# Altium project InductSense-v0.PrjPcb
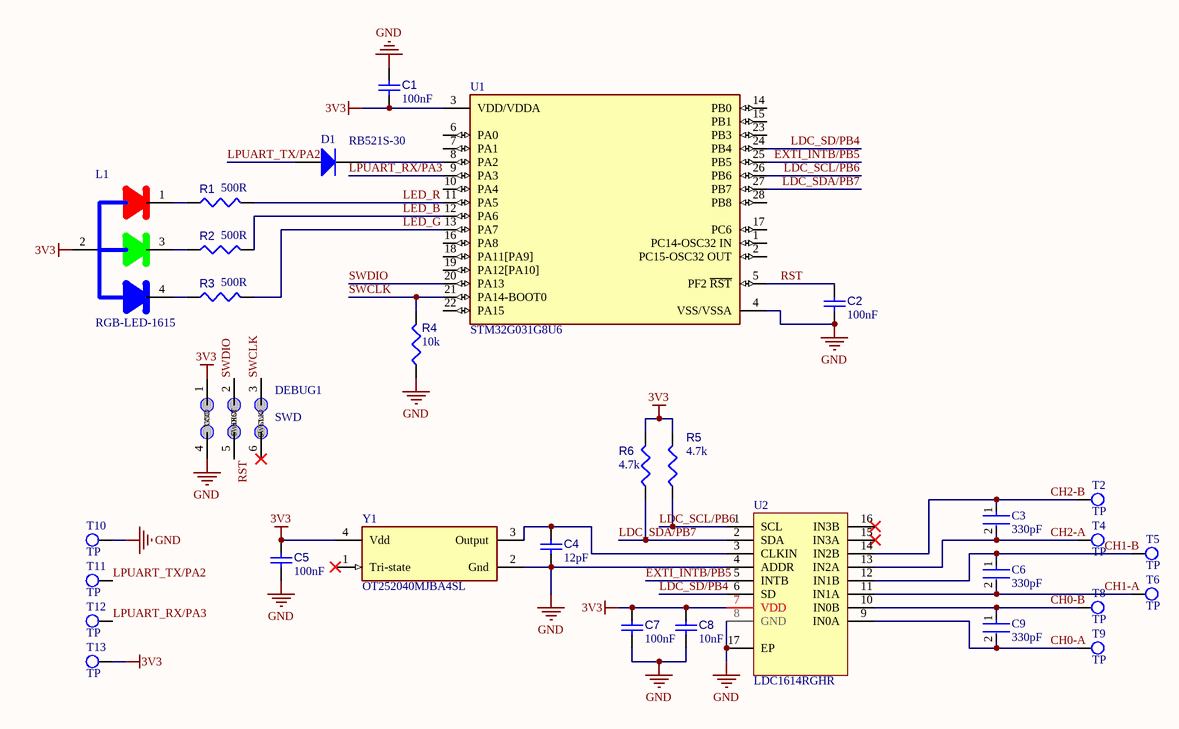
[diagram p0: Sheet1.SchDoc]
1 sheet, 31 parts. Net scope: global (net labels, ports and power ports of the same name join across sheets).
Board files: v0.0.PcbDoc, iForce-FPC.PcbDoc, v0.1.PcbDoc, iForce-FPC-V0.1.PcbDoc

## Sheet Sheet1.SchDoc
size A4; SheetNumber: 1; SheetTotal: 1

### Parts
C1  value 100nF  [CAPC0402(1005)60_L]  (hidden comment: Capacitor 100nF +/-20% 10V 0402)
C2  value 100nF  [CAPC0402(1005)60_L]  (hidden comment: Capacitor 100nF +/-20% 10V 0402)
C3  330pF  [FP-C0201-AB-MFG]
C4  value 12pF  [CAPC0402(1005)33_L]  (hidden comment: Capacitor 12pF +/-10% 50V 0402)
C5  value 100nF  [CAPC0402(1005)60_L]  (hidden comment: Capacitor 100nF +/-20% 10V 0402)
C6  330pF  [FP-C0201-AB-MFG]
C7  value 100nF  [CAPC0402(1005)60_L]  (hidden comment: Capacitor 100nF +/-20% 10V 0402)
C8  value 10nF  [CAPC0402(1005)60_L]  (hidden comment: Capacitor 100nF +/-20% 10V 0402)
C9  330pF  [FP-C0201-AB-MFG]
D1  RB521S-30  [DIOD-SOD523-2_V]
DEBUG1  SWD  [DEBUG-2x3P-1.27mm Pitch]
L1  RGB-LED-1615  [RGB-LED-1615-Footprint-1]
R1  value 500R  [RESC0402(1005)_L]  (hidden comment: Resistor 100R +/-1 % 0402 63 mW)
R2  value 500R  [RESC0402(1005)_L]  (hidden comment: Resistor 100R +/-1 % 0402 63 mW)
R3  value 500R  [RESC0402(1005)_L]  (hidden comment: Resistor 100R +/-1 % 0402 63 mW)
R4  value 10k  [RESC0402(1005)_L]  (hidden comment: Resistor 10K  +/-1 % 0402 63 mW)
R5  value 4.7k  [RESC0402(1005)_L]  (hidden comment: Resistor 4K7  +/-1 % 0402 63 mW)
R6  value 4.7k  [RESC0402(1005)_L]  (hidden comment: Resistor 4K7  +/-1 % 0402 63 mW)
T2  TP  [TESTPOINT-Rectangle-1.5x3]
T4  TP  [TESTPOINT-Rectangle-1.5x3]
T5  TP  [TESTPOINT-Rectangle-1.5x3]
T6  TP  [TESTPOINT-Rectangle-1.5x3]
T8  TP  [TESTPOINT-Rectangle-1.5x3]
T9  TP  [TESTPOINT-Rectangle-1.5x3]
T10  TP  [TESTPOINT-Rectangle-1.5x3]
T11  TP  [TESTPOINT-Rectangle-1.5x3]
T12  TP  [TESTPOINT-Rectangle-1.5x3]
T13  TP  [TESTPOINT-Rectangle-1.5x3]
U1  STM32G031G8U6  [FP-UFQFPN28-A0B0-MFG]
U2  LDC1614RGHR  [LDC1614RGHR-Footprint-1]
Y1  OT252040MJBA4SL  [FP-ECS-TXO-2520-MFG]

### Nets
3V3: C1.1 C5.2 C7.2 C8.2 DEBUG1.1(VCC) L1.2(COM+) R5.2 R6.2 T13.1 U1.3(VDD/VDDA) U2.7(VDD) Y1.4(Vdd)
GND: C1.2 C2.1 C4.1 C5.1 C7.1 C8.1 DEBUG1.4(GND) R4.1 T10.1 U1.4(VSS/VSSA) U2.4(ADDR) U2.8(GND) U2.17(EP) Y1.2(Gnd)
CH0-A: C9.2 T9.1 U2.9(IN0A)
CH0-B: C9.1 T8.1 U2.10(IN0B)
CH1-A: C6.2 T6.1 U2.11(IN1A)
CH1-B: C6.1 T5.1 U2.12(IN1B)
CH2-A: C3.2 T4.1 U2.13(IN2A)
CH2-B: C3.1 T2.1 U2.14(IN2B)
EXTI_INTB/PB5: U1.25(PB5) U2.5(INTB)
LDC_SCL/PB6: R5.1 U1.26(PB6) U2.1(SCL)
LDC_SD/PB4: U1.24(PB4) U2.6(SD)
LDC_SDA/PB7: R6.1 U1.27(PB7) U2.2(SDA)
LED_B: R2.2 U1.12(PA6)
LED_G: R3.2 U1.13(PA7)
LED_R: R1.2 U1.11(PA5)
LPUART_RX/PA3: T12.1 U1.9(PA3)
LPUART_TX/PA2: D1.1(A) T11.1
RST: C2.2 DEBUG1.5(nRST) U1.5(PF2_~{RST})
SWCLK: DEBUG1.3(SWCLK) R4.2 U1.21(PA14-BOOT0)
SWDIO: DEBUG1.2(SWDIO) U1.20(PA13)
NetC4_2: C4.2 U2.3(CLKIN) Y1.3(Output)
NetD1_2: D1.2(K) U1.8(PA2)
NetL1_1: L1.1(R) R1.1
NetL1_3: L1.3(G) R2.1
NetL1_4: L1.4(B) R3.1

Not connected (* = marked no-connect by the designer): DEBUG1 6(SWO)*; U1 1(PC14-OSC32_IN) 2(PC15-OSC32_OUT) 6(PA0) 7(PA1) 10(PA4) 14(PB0) 15(PB1) 16(PA8) 17(PC6) 18(PA11[PA9]) 19(PA12[PA10]) 22(PA15) 23(PB3) 28(PB8); U2 15(IN3A)* 16(IN3B)*; Y1 1(Tri-state)*

### Library data of the parts
C1 C2 C5 C7 C8 = CMP-001-00061-3: Chip Capacitor, 100nF +/-20%, 10V, 0402, Thickness 0.6 mm; Tolerance: 20%; Mounting Technology: SMT; Voltage Rating: 10V; Max Operating Temperature: 85°C; Pins: 2; Case/Package: 0402; Min Operating Temperature: -55°C
C3 C6 C9 = CMP-03020-034506-1: CAP CER 18PF 25V 5% NP0 0201; Manufacturer Part Number: C0201C180J3GACTU; Manufacturer: KEMET; Material: Ceramic; Description: C0201 18 pF C0G 30ppm/°C 5.00% 25 V; Tolerance: 0.05; Standoff Height: 0mm; Temperature Coefficient: 30ppm/°C; Temperature Characteristic: C0G; Ipc Land Pattern Name: CAPC6030X30; ComponentLink2Description: Datasheet; Capacitance: 18 pF; Package: C0201-AB; Device Class L3: Ceramic Capacitors; Category: Cap; Value: 18 pF; Device Class L2: Capacitors; Temperature Range Low: -55°C; Lead Free: Yes; Digikey Description: CAP CER 18PF 25V 5% NP0 0201; Voltage Rating: 25 V; RoHS: TRUE; Temperature: -55°C to +125°C; Octopart: https://octopart.com/c0201c180j3gactu-kemet-17105352; Device Class L1: Passive Components; Mouser Description: Multilayer Ceramic Capacitors MLCC - SMD/SMT 25volts 18pF C0G 5%; ComponentLink2URL: https://content.kemet.com/datasheets/KEM_C1003_C0G_SMD.pdf; Automotive: No; Temperature Range High: +125°C; Height: 0.33mm
C4 = CMP-001-00072-4: Chip Capacitor, 12pF +/-10%, 50V, 0402, Thickness 0.33 mm; Tolerance: 20%; Pins: 2; Max Operating Temperature: 85°C; Case/Package: 0402; Voltage Rating: 50V; Mounting Technology: SMT; Min Operating Temperature: -55°C
D1 = CMP-2000-05518-2: Surface Mount Fast Switching Diode, -65 to 150 degC, 2-Pin SOD523, RoHS, Tape and Reel; PartNumber: 1N4148WT; Manufacturer: Diodes Inc; Diode Configuration: Single; Number of Elements per Chip: 1; Forward Current: 250mA; Datasheet URL: http://www.diodes.com/_files/datasheets/ds30396.pdf; Mounting Technology: SurfaceMount; Manufacturer URL: http://www.diodes.com/; Package URL: http://www.diodes.com/_files/packages/SOD523.pdf; Pin Count: 2; Package Description: 2-Pin Small Outline Diode, Body 1.2 x 0.8 mm; Package Reference: SOD523-2; Mounting Type: SurfaceMount; Package Type: SOD-523; Datasheet Version: Rev. 16-2, 11/2015
DEBUG1 = DEBUG-PogoPin-2x6P: 弹簧探针烧录/调试触点
L1 = CMP-007-00036-2: RGB LED
R1-R3 = CMP-009-00167-3: Chip Resistor, 100 Ohms, +/-1 %, 63 mW, -55 to 155 degC, 0402; Power: 63mW; Tolerance: 1%; Min Operating Temperature: -55°C; Case/Package: 0402; Pins: 2; Max Operating Temperature: 155°C
R4 = CMP-009-00149-3: Chip Resistor, 10 kOhms, +/-1 %, 63 mW, -55 to 125 degC, 0402; Power: 63mW; Tolerance: 1%; Min Operating Temperature: -55°C; Case/Package: 0402; Max Operating Temperature: 155°C; Pins: 2
R5 R6 = CMP-009-00158-3: Chip Resistor, 4,7 kOhms, +/-1 %, 63 mW, -55 to 155 degC, 0402; Power: 63mW; Tolerance: 1%; Max Operating Temperature: 155°C; Pins: 2; Min Operating Temperature: -55°C; Case/Package: 0402
T2 T4-T6 T8-T13 = TestPoint
U1 = CMP-031-00013-1: MCU 32-Bit ARM Cortex-M0+ RISC 64KB Flash 1.7V to 3.6V 28-Pin UFQFPN Tray; Min Operating Temperature: -40°C; Mounting Technology: Surface Mount; Pins: 28; Case/Package: UFQFPN; Max Operating Temperature: 85°C
U2 = CMP-031-00006-3: 4-Ch, 28-bit, high-resolution Inductance to digital converter 16-WQFN -40 to 125; Pins: 16; Max Operating Temperature: 125°C; Mounting Technology: Surface Mount; RoHS Compliant: Yes; Min Operating Temperature: -40°C
Y1 = CMP-40224-000034-1: XTAL OSC TCXO 25.0000MHZ HCMOS; RoHS Compliant: Yes